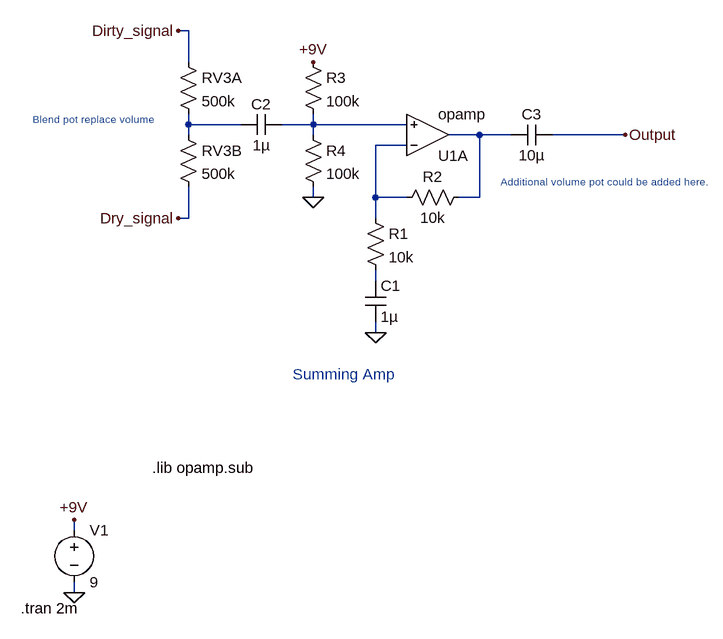
[diagram p0: schematic opamp options.asc]
opamp options.asc, the LTspice schematic file:
Version 4
SHEET 1 928 936
WIRE -112 32 -128 32
WIRE -112 80 -112 32
WIRE -112 176 -112 160
WIRE -32 176 -112 176
WIRE 80 176 80 160
WIRE 80 176 32 176
WIRE 224 176 80 176
WIRE -112 192 -112 176
WIRE 80 192 80 176
WIRE 336 192 288 192
WIRE 384 192 336 192
WIRE 560 192 448 192
WIRE 224 208 176 208
WIRE 80 288 80 272
WIRE 176 288 176 208
WIRE 224 288 176 288
WIRE 336 288 336 192
WIRE 336 288 304 288
WIRE -112 320 -112 272
WIRE -112 320 -128 320
WIRE 176 320 176 288
WIRE 176 416 176 400
WIRE 176 496 176 480
WIRE -288 800 -288 784
WIRE -288 896 -288 880
FLAG -128 32 Dirty_signal
FLAG 176 496 0
FLAG -128 320 Dry_signal
FLAG 80 80 +9V
FLAG 80 288 0
FLAG -288 896 0
FLAG -288 784 +9V
FLAG 560 192 Output
SYMBOL res -128 64 R0
SYMATTR InstName RV3A
SYMATTR Value 500k
SYMBOL res -128 176 R0
SYMATTR InstName RV3B
SYMATTR Value 500k
SYMBOL Opamps\\opamp 256 256 M180
SYMATTR InstName U1A
SYMBOL res 160 304 R0
SYMATTR InstName R1
SYMATTR Value 10k
SYMBOL cap 160 416 R0
SYMATTR InstName C1
SYMATTR Value 1µ
SYMBOL res 320 272 R90
WINDOW 0 0 56 VBottom 2
WINDOW 3 32 56 VTop 2
SYMATTR InstName R2
SYMATTR Value 10k
SYMBOL voltage -288 784 R0
WINDOW 123 0 0 Left 2
WINDOW 39 0 0 Left 2
SYMATTR InstName V1
SYMATTR Value 9
SYMBOL res 64 64 R0
SYMATTR InstName R3
SYMATTR Value 100k
SYMBOL res 64 176 R0
SYMATTR InstName R4
SYMATTR Value 100k
SYMBOL cap 32 160 R90
WINDOW 0 0 32 VBottom 2
WINDOW 3 32 32 VTop 2
SYMATTR InstName C2
SYMATTR Value 1µ
SYMBOL cap 448 176 R90
WINDOW 0 0 32 VBottom 2
WINDOW 3 32 32 VTop 2
SYMATTR InstName C3
SYMATTR Value 10µ
TEXT -352 168 Left 1 ;Blend pot replace volume
TEXT 48 560 Left 2 ;Summing Amp
TEXT -168 704 Left 2 !.lib opamp.sub
TEXT -370 920 Left 2 !.tran 2m
TEXT 368 264 Left 1 ;Additional volume pot could be added here.

The netlist it stands for:
* opamp options.asc
RV3A Dirty_signal N001 500k
RV3B N001 Dry_signal 500k
XU1A N004 N002 N003 opamp Aol=100K GBW=10Meg  ; pins invin noninvin out
R1 N004 N005 10k
C1 N005 0 1µ
R2 N003 N004 10k
V1 +9V 0 9
R3 +9V N002 100k
R4 N002 0 100k
C2 N002 N001 1µ
C3 Output N003 10µ
* Blend pot replace volume
* Summing Amp
.lib opamp.sub
.tran 2m
* Additional volume pot could be added here.
.backanno
.end